# EasyEDA Pro project KeysDock.eprj, schematic keyboard

## Sheets
1 led: Board Name: keyboard; Create Date: 2025-10-22; Page Name: led; Project Name: KeysDock; Schematic Name: keyboard; Update Date: 2025-10-25; Company: keys.woooo.tech; Drawed: Reverier-Xu; Page Size: A4; Version: V1.0
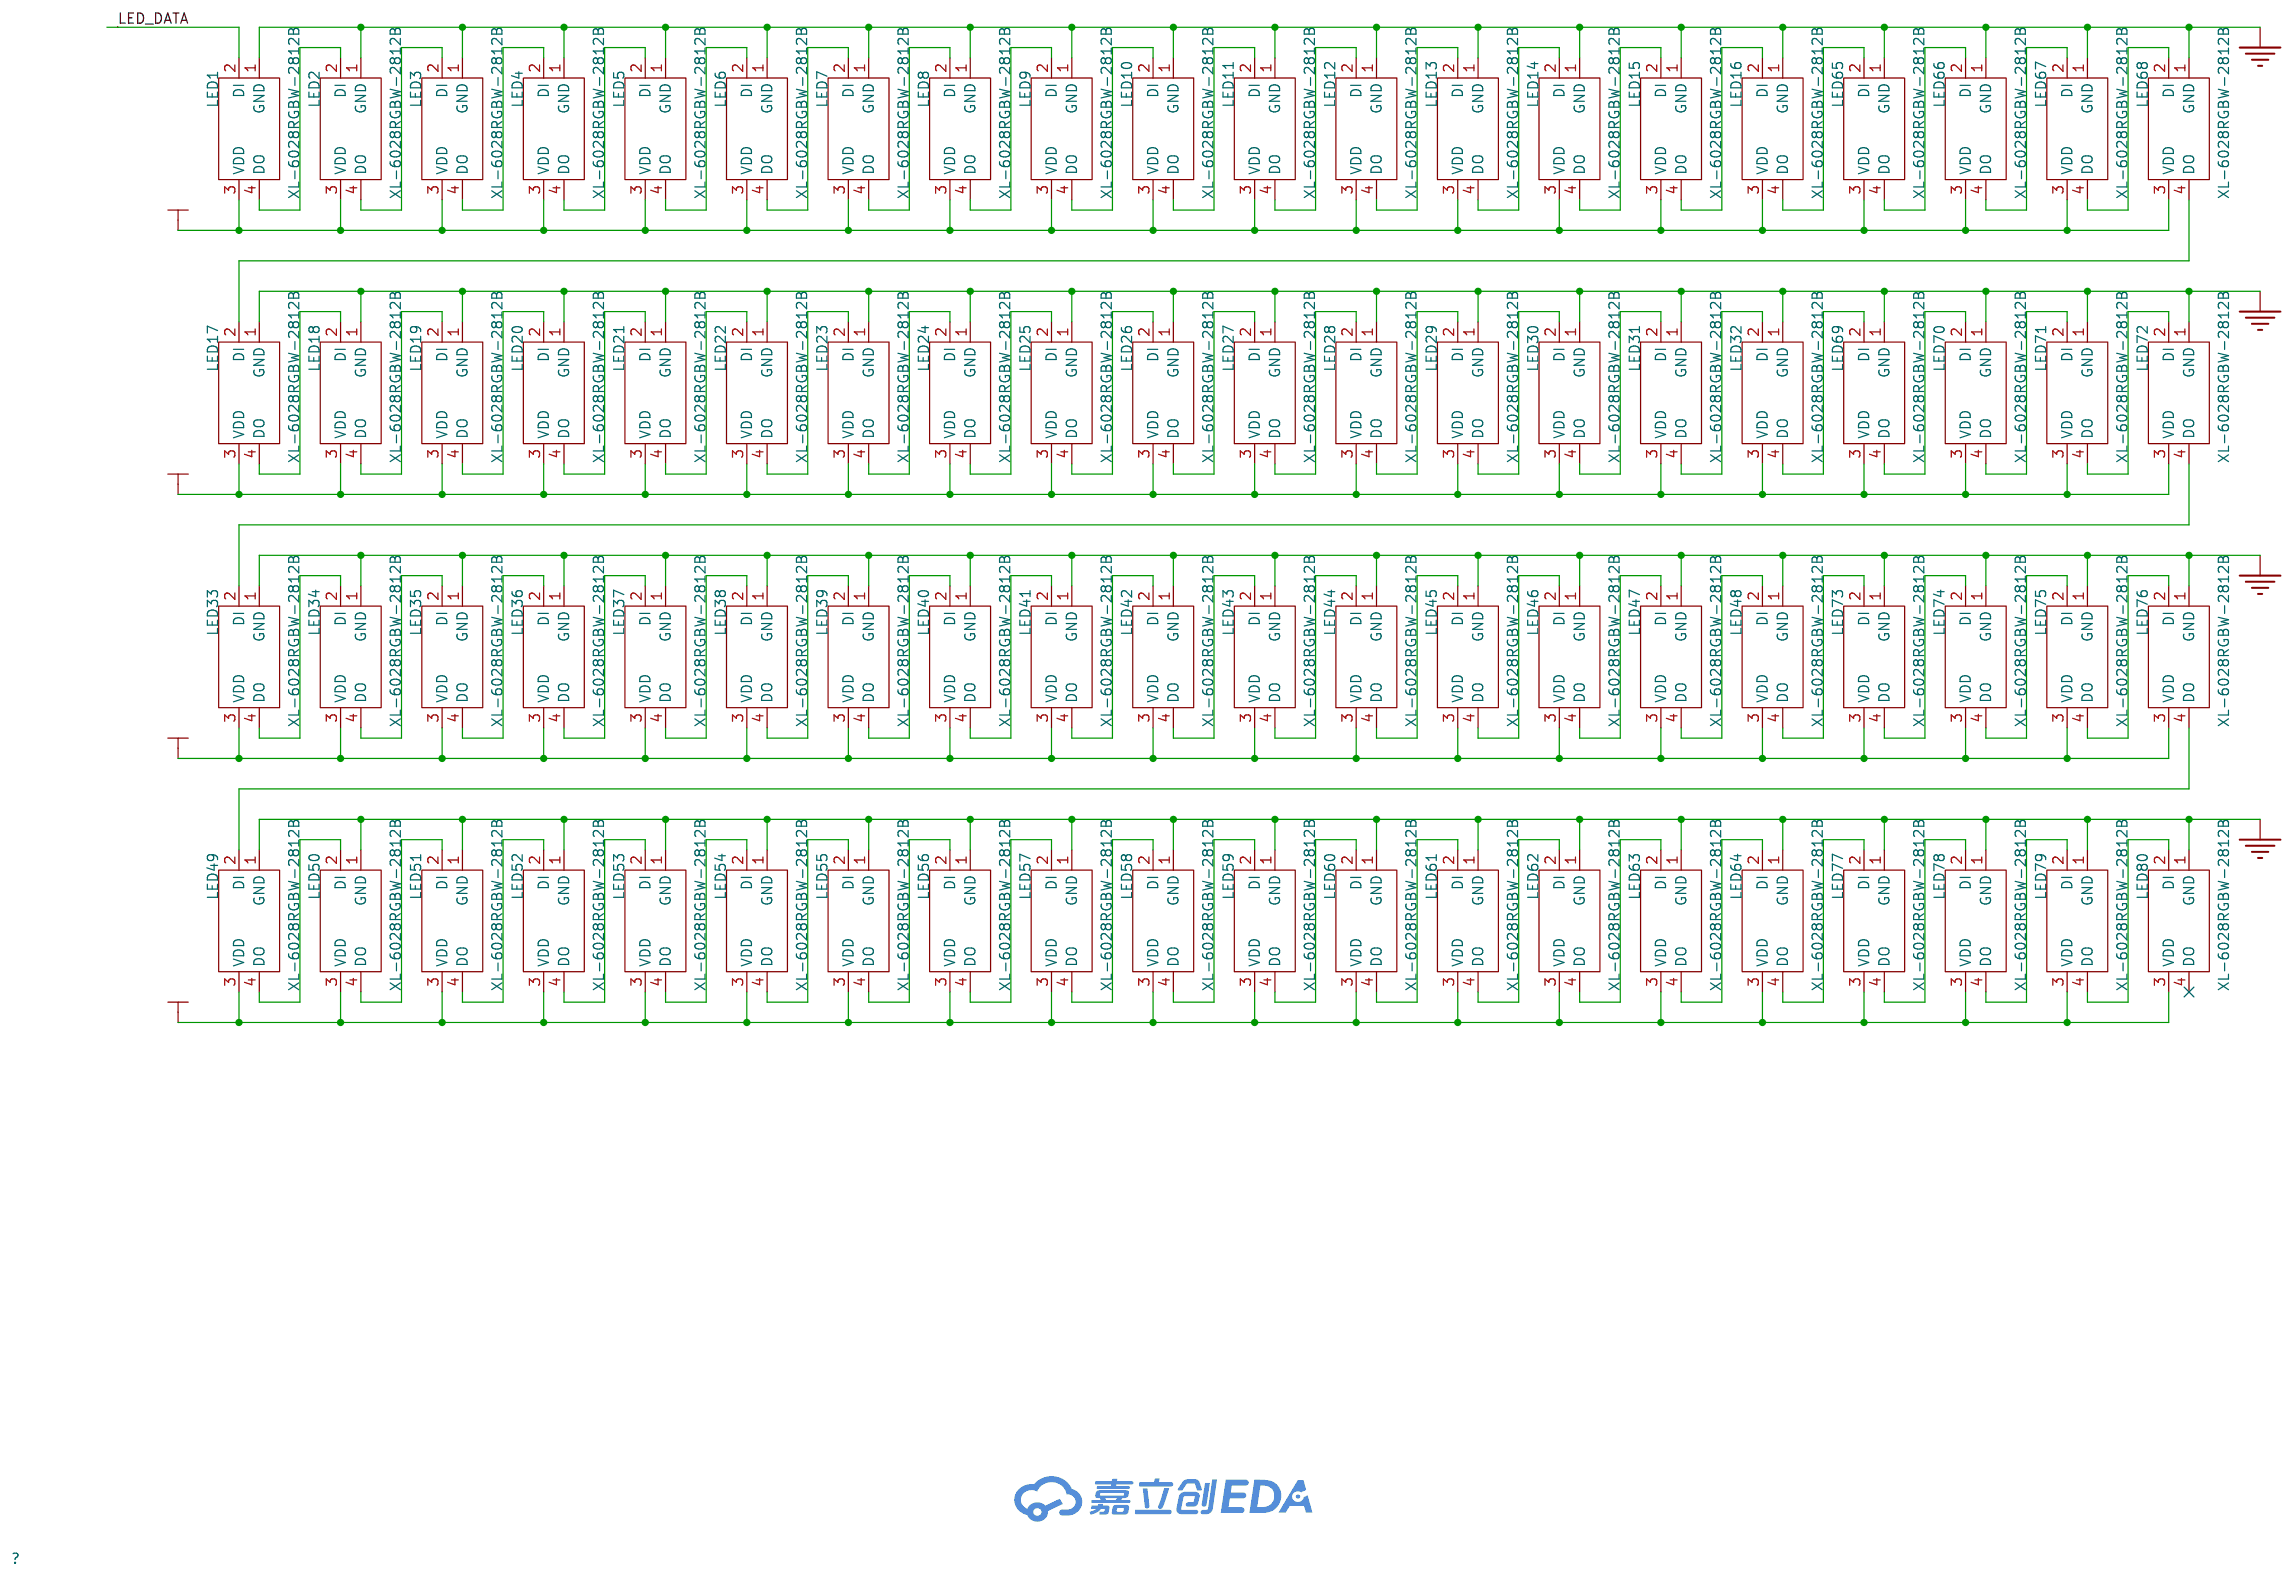
[diagram p4: led]
2 keys: Page Name: keys; Update Date: 2025-10-22
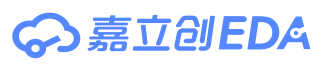
[diagram p5: keys]
3 connector: Create Date: 2025-10-25; Page Name: connector
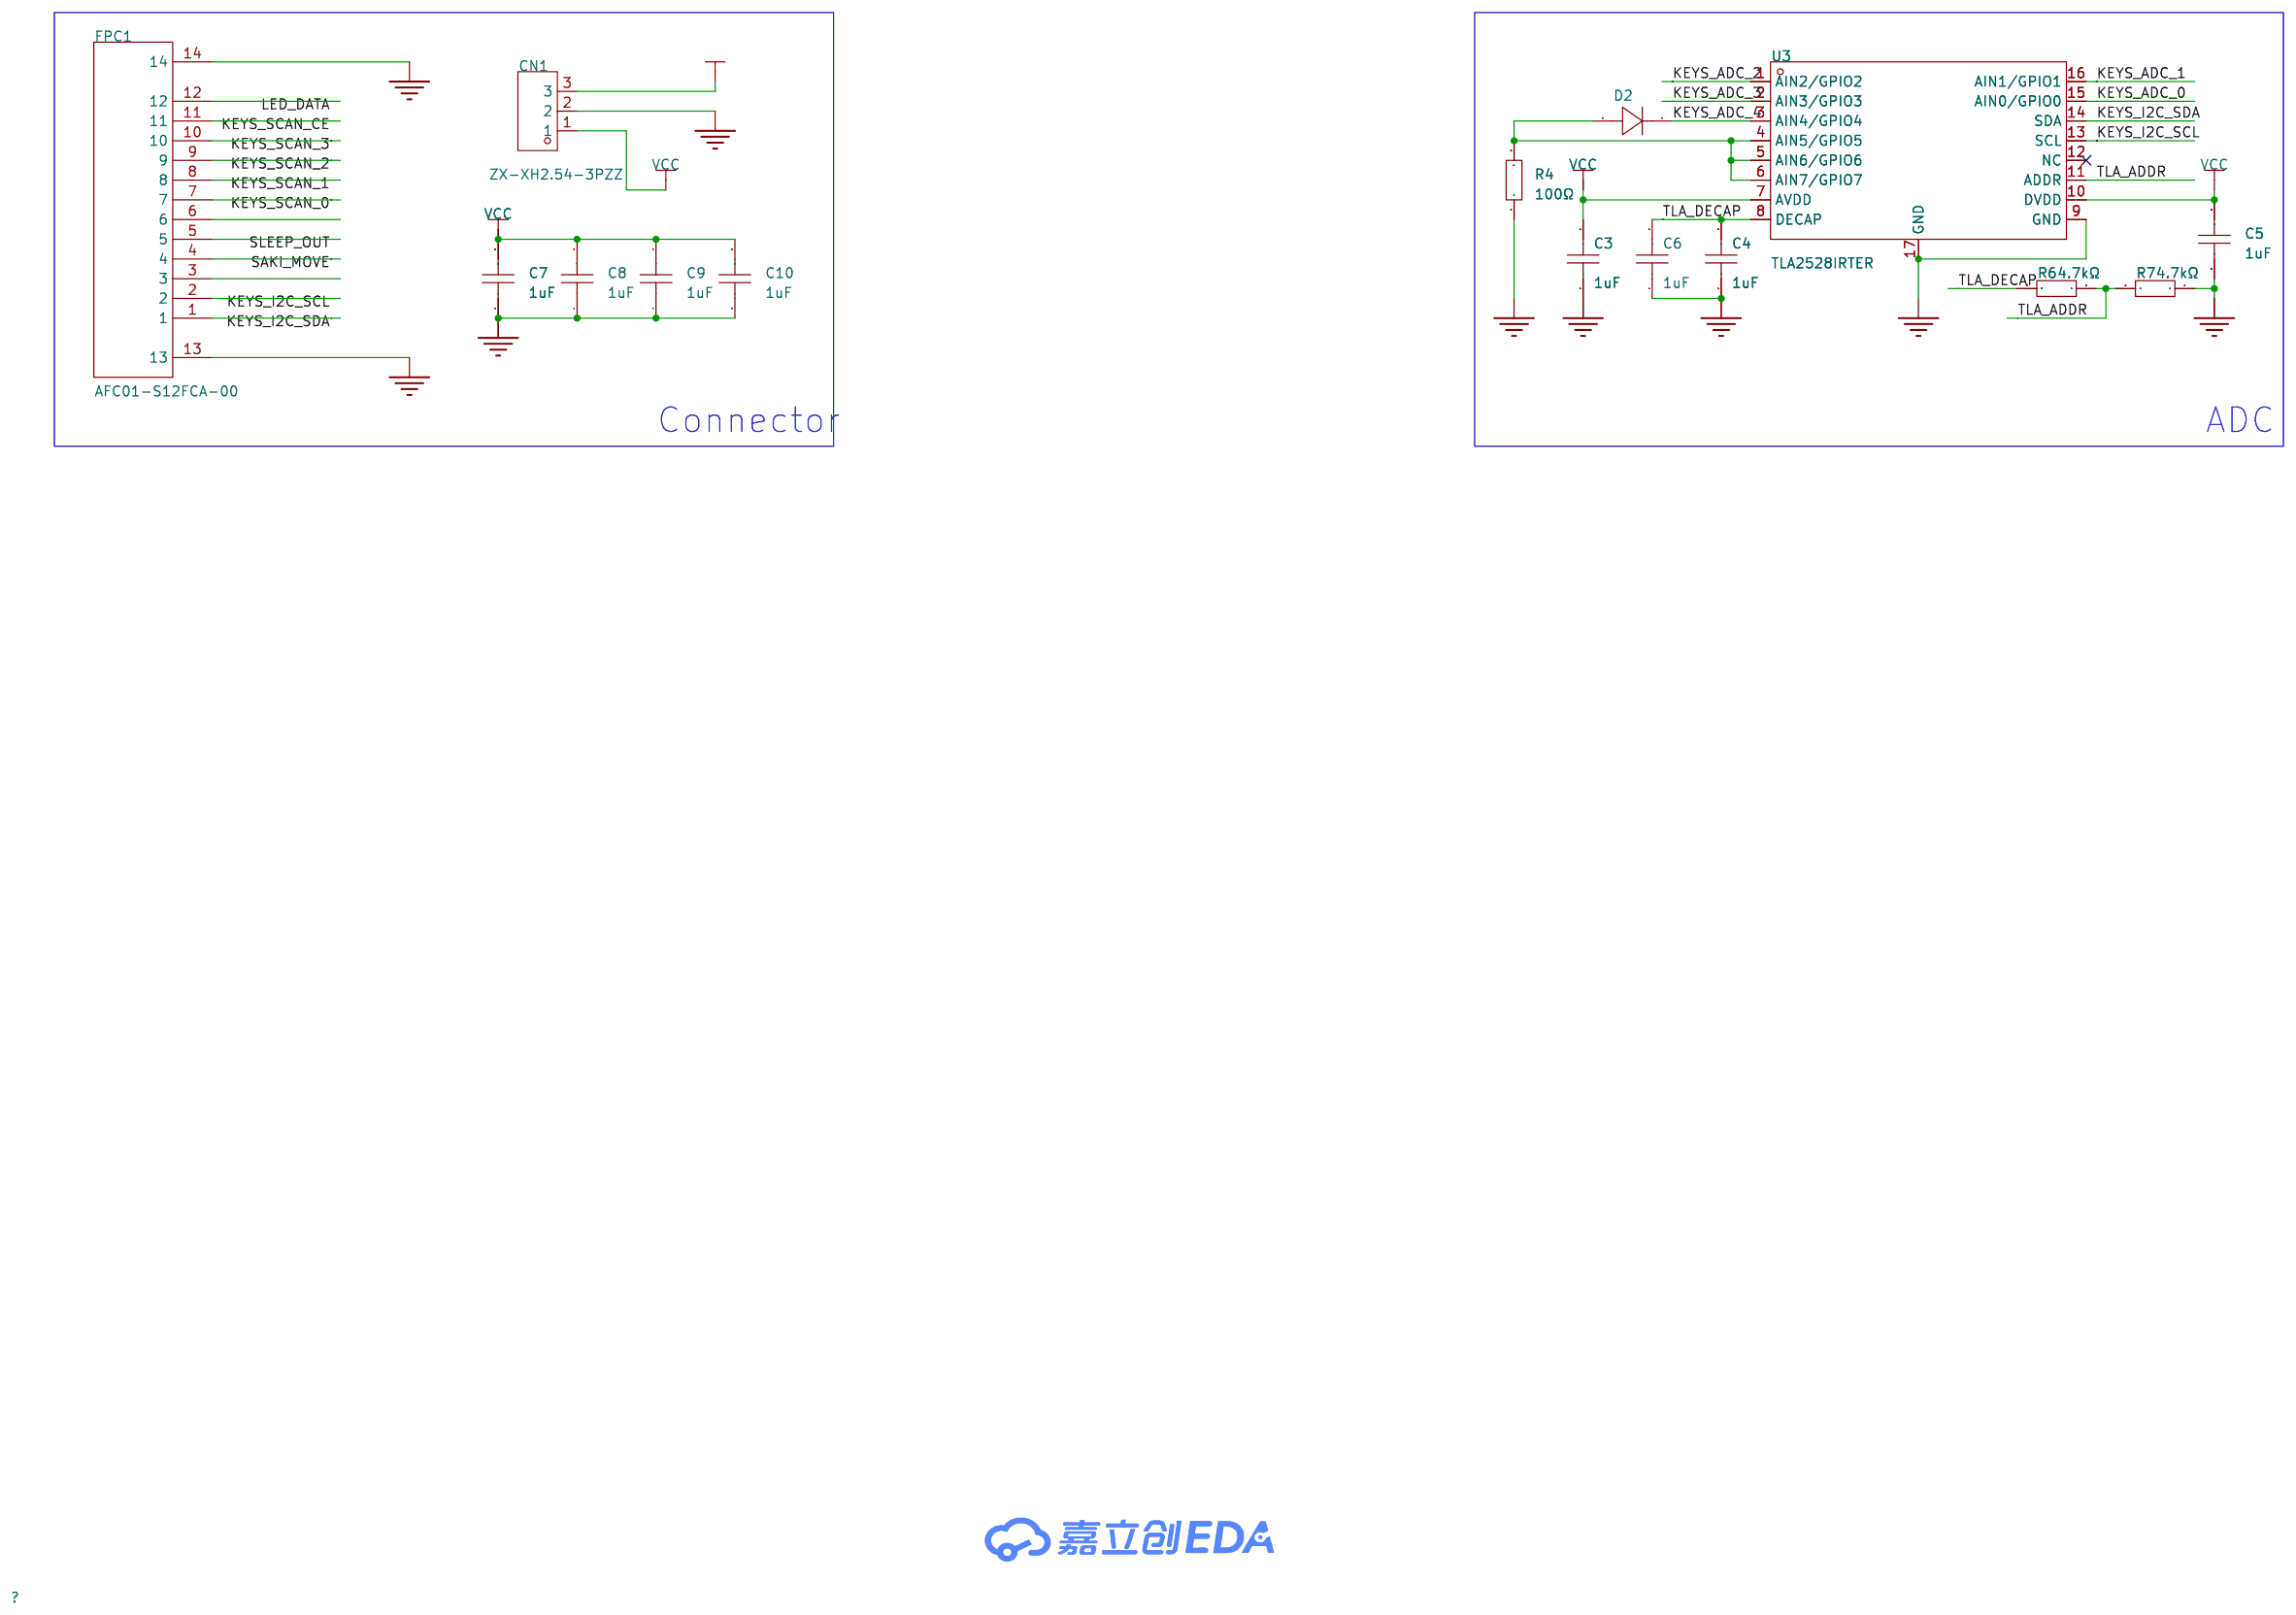
[diagram p6: connector]

## Parts
sheet connector
C3  1uF  [C0603]
C4  1uF  [C0603]
C5  1uF  [C0603]
C6  1uF  [C0603]
C7  1uF  [C0603]
C8  1uF  [C0603]
C9  1uF  [C0603]
C10  1uF  [C0603]
CN1  ZX-XH2.54-3PZZ  [CONN-TH_3P-P2.54_2501S-3P]
D2  -  [DO_1N4007]
FPC1  AFC01-S12FCA-00  [FPC-SMD_AFC01-S12FCA-00]
R4  100Ω  [R0402]
R6  4.7kΩ  [R0402]
R7  4.7kΩ  [R0402]
U3  TLA2528IRTER  [WQFN-16_L3.0-W3.0-P0.50-TL-EP1.7]
sheet led
LED1  XL-6028RGBW-2812B  [LED-SMD_4P_XL-6028RGBW-WS2812B]
LED2  XL-6028RGBW-2812B  [LED-SMD_4P_XL-6028RGBW-WS2812B]
LED3  XL-6028RGBW-2812B  [LED-SMD_4P_XL-6028RGBW-WS2812B]
LED4  XL-6028RGBW-2812B  [LED-SMD_4P_XL-6028RGBW-WS2812B]
LED5  XL-6028RGBW-2812B  [LED-SMD_4P_XL-6028RGBW-WS2812B]
LED6  XL-6028RGBW-2812B  [LED-SMD_4P_XL-6028RGBW-WS2812B]
LED7  XL-6028RGBW-2812B  [LED-SMD_4P_XL-6028RGBW-WS2812B]
LED8  XL-6028RGBW-2812B  [LED-SMD_4P_XL-6028RGBW-WS2812B]
LED9  XL-6028RGBW-2812B  [LED-SMD_4P_XL-6028RGBW-WS2812B]
LED10  XL-6028RGBW-2812B  [LED-SMD_4P_XL-6028RGBW-WS2812B]
LED11  XL-6028RGBW-2812B  [LED-SMD_4P_XL-6028RGBW-WS2812B]
LED12  XL-6028RGBW-2812B  [LED-SMD_4P_XL-6028RGBW-WS2812B]
LED13  XL-6028RGBW-2812B  [LED-SMD_4P_XL-6028RGBW-WS2812B]
LED14  XL-6028RGBW-2812B  [LED-SMD_4P_XL-6028RGBW-WS2812B]
LED15  XL-6028RGBW-2812B  [LED-SMD_4P_XL-6028RGBW-WS2812B]
LED16  XL-6028RGBW-2812B  [LED-SMD_4P_XL-6028RGBW-WS2812B]
LED17  XL-6028RGBW-2812B  [LED-SMD_4P_XL-6028RGBW-WS2812B]
LED18  XL-6028RGBW-2812B  [LED-SMD_4P_XL-6028RGBW-WS2812B]
LED19  XL-6028RGBW-2812B  [LED-SMD_4P_XL-6028RGBW-WS2812B]
LED20  XL-6028RGBW-2812B  [LED-SMD_4P_XL-6028RGBW-WS2812B]
LED21  XL-6028RGBW-2812B  [LED-SMD_4P_XL-6028RGBW-WS2812B]
LED22  XL-6028RGBW-2812B  [LED-SMD_4P_XL-6028RGBW-WS2812B]
LED23  XL-6028RGBW-2812B  [LED-SMD_4P_XL-6028RGBW-WS2812B]
LED24  XL-6028RGBW-2812B  [LED-SMD_4P_XL-6028RGBW-WS2812B]
LED25  XL-6028RGBW-2812B  [LED-SMD_4P_XL-6028RGBW-WS2812B]
LED26  XL-6028RGBW-2812B  [LED-SMD_4P_XL-6028RGBW-WS2812B]
LED27  XL-6028RGBW-2812B  [LED-SMD_4P_XL-6028RGBW-WS2812B]
LED28  XL-6028RGBW-2812B  [LED-SMD_4P_XL-6028RGBW-WS2812B]
LED29  XL-6028RGBW-2812B  [LED-SMD_4P_XL-6028RGBW-WS2812B]
LED30  XL-6028RGBW-2812B  [LED-SMD_4P_XL-6028RGBW-WS2812B]
LED31  XL-6028RGBW-2812B  [LED-SMD_4P_XL-6028RGBW-WS2812B]
LED32  XL-6028RGBW-2812B  [LED-SMD_4P_XL-6028RGBW-WS2812B]
LED33  XL-6028RGBW-2812B  [LED-SMD_4P_XL-6028RGBW-WS2812B]
LED34  XL-6028RGBW-2812B  [LED-SMD_4P_XL-6028RGBW-WS2812B]
LED35  XL-6028RGBW-2812B  [LED-SMD_4P_XL-6028RGBW-WS2812B]
LED36  XL-6028RGBW-2812B  [LED-SMD_4P_XL-6028RGBW-WS2812B]
LED37  XL-6028RGBW-2812B  [LED-SMD_4P_XL-6028RGBW-WS2812B]
LED38  XL-6028RGBW-2812B  [LED-SMD_4P_XL-6028RGBW-WS2812B]
LED39  XL-6028RGBW-2812B  [LED-SMD_4P_XL-6028RGBW-WS2812B]
LED40  XL-6028RGBW-2812B  [LED-SMD_4P_XL-6028RGBW-WS2812B]
LED41  XL-6028RGBW-2812B  [LED-SMD_4P_XL-6028RGBW-WS2812B]
LED42  XL-6028RGBW-2812B  [LED-SMD_4P_XL-6028RGBW-WS2812B]
LED43  XL-6028RGBW-2812B  [LED-SMD_4P_XL-6028RGBW-WS2812B]
LED44  XL-6028RGBW-2812B  [LED-SMD_4P_XL-6028RGBW-WS2812B]
LED45  XL-6028RGBW-2812B  [LED-SMD_4P_XL-6028RGBW-WS2812B]
LED46  XL-6028RGBW-2812B  [LED-SMD_4P_XL-6028RGBW-WS2812B]
LED47  XL-6028RGBW-2812B  [LED-SMD_4P_XL-6028RGBW-WS2812B]
LED48  XL-6028RGBW-2812B  [LED-SMD_4P_XL-6028RGBW-WS2812B]
LED49  XL-6028RGBW-2812B  [LED-SMD_4P_XL-6028RGBW-WS2812B]
LED50  XL-6028RGBW-2812B  [LED-SMD_4P_XL-6028RGBW-WS2812B]
LED51  XL-6028RGBW-2812B  [LED-SMD_4P_XL-6028RGBW-WS2812B]
LED52  XL-6028RGBW-2812B  [LED-SMD_4P_XL-6028RGBW-WS2812B]
LED53  XL-6028RGBW-2812B  [LED-SMD_4P_XL-6028RGBW-WS2812B]
LED54  XL-6028RGBW-2812B  [LED-SMD_4P_XL-6028RGBW-WS2812B]
LED55  XL-6028RGBW-2812B  [LED-SMD_4P_XL-6028RGBW-WS2812B]
LED56  XL-6028RGBW-2812B  [LED-SMD_4P_XL-6028RGBW-WS2812B]
LED57  XL-6028RGBW-2812B  [LED-SMD_4P_XL-6028RGBW-WS2812B]
LED58  XL-6028RGBW-2812B  [LED-SMD_4P_XL-6028RGBW-WS2812B]
LED59  XL-6028RGBW-2812B  [LED-SMD_4P_XL-6028RGBW-WS2812B]
LED60  XL-6028RGBW-2812B  [LED-SMD_4P_XL-6028RGBW-WS2812B]
LED61  XL-6028RGBW-2812B  [LED-SMD_4P_XL-6028RGBW-WS2812B]
LED62  XL-6028RGBW-2812B  [LED-SMD_4P_XL-6028RGBW-WS2812B]
LED63  XL-6028RGBW-2812B  [LED-SMD_4P_XL-6028RGBW-WS2812B]
LED64  XL-6028RGBW-2812B  [LED-SMD_4P_XL-6028RGBW-WS2812B]
LED65  XL-6028RGBW-2812B  [LED-SMD_4P_XL-6028RGBW-WS2812B]
LED66  XL-6028RGBW-2812B  [LED-SMD_4P_XL-6028RGBW-WS2812B]
LED67  XL-6028RGBW-2812B  [LED-SMD_4P_XL-6028RGBW-WS2812B]
LED68  XL-6028RGBW-2812B  [LED-SMD_4P_XL-6028RGBW-WS2812B]
LED69  XL-6028RGBW-2812B  [LED-SMD_4P_XL-6028RGBW-WS2812B]
LED70  XL-6028RGBW-2812B  [LED-SMD_4P_XL-6028RGBW-WS2812B]
LED71  XL-6028RGBW-2812B  [LED-SMD_4P_XL-6028RGBW-WS2812B]
LED72  XL-6028RGBW-2812B  [LED-SMD_4P_XL-6028RGBW-WS2812B]
LED73  XL-6028RGBW-2812B  [LED-SMD_4P_XL-6028RGBW-WS2812B]
LED74  XL-6028RGBW-2812B  [LED-SMD_4P_XL-6028RGBW-WS2812B]
LED75  XL-6028RGBW-2812B  [LED-SMD_4P_XL-6028RGBW-WS2812B]
LED76  XL-6028RGBW-2812B  [LED-SMD_4P_XL-6028RGBW-WS2812B]
LED77  XL-6028RGBW-2812B  [LED-SMD_4P_XL-6028RGBW-WS2812B]
LED78  XL-6028RGBW-2812B  [LED-SMD_4P_XL-6028RGBW-WS2812B]
LED79  XL-6028RGBW-2812B  [LED-SMD_4P_XL-6028RGBW-WS2812B]
LED80  XL-6028RGBW-2812B  [LED-SMD_4P_XL-6028RGBW-WS2812B]

## Library data of the parts
C3-C10 = CAP_0603: Supplier Footprint: 0603
CN1 = ZX-XH2.54-3PZZ: LCSC Part Name: 1x3P 间距:2.5mm 直插 系列:XH; Supplier Part: C7429633; Manufacturer: Megastar(兆星); Supplier Footprint: 插件,P=2.5mm; JLCPCB Part Class: 扩展库; Datasheet: https://item.szlcsc.com/datasheet/ZX-XH2.54-3PZZ/8427550.html; Supplier: LCSC; Pins Structure: 1x3P; Pitch: 2.5mm; Mounting Type: 直插; Reference Series: XH; Number of Pins: 3P; Number of Rows: 1; Number of PINs Per Row: 3; Current Rating: 3A; Contact Material: 黄铜; Contact Plating: 锡; Operating Temperature: -25℃~+85℃; Voltage Rating: 250V; Plastic Material: PA66; Flame Retardant Rating: UL94V-0; Color: 白色; Z-Height of the Board: 7mm; X-Length of Bottom Edge on Board (Spacing Line): 10mm; Y-Width of Bottom Edge on Board: 5.9mm
D2 = D_1N4007A: Supplier Footprint: DO-41
FPC1 = AFC01-S12FCA-00: LCSC Part Name: 间距:0.5mm P数:12P 翻盖式 下接; Supplier Part: C262661; Manufacturer: JS(钜硕电子); Supplier Footprint: SMD,P=0.5mm,卧贴; JLCPCB Part Class: 扩展库; Datasheet: https://item.szlcsc.com/datasheet/AFC01-S12FCA-00/253920.html; Supplier: LCSC; Locking Feature: 翻盖式; Contact Type: 下接; Number of Contacts: 12P; Pitch: 0.5mm; Mounting Type: 卧贴; FFC, FCB Thickness: 0.3mm; Height Above Board: 2mm
R4 = 0402WGF1000TCE: LCSC Part Name: 100Ω ±1% 62.5mW 厚膜电阻; Supplier Part: C25076; Manufacturer: UNI-ROYAL(厚声); Supplier Footprint: 0402; JLCPCB Part Class: Basic Part; Datasheet: https://atta.szlcsc.com/upload/public/pdf/source/20200306/C422600_1E6D84923E4A46A82E41ADD87F860B5C.pdf; Supplier: LCSC; Type: 厚膜电阻; Tolerance: ±1%; Power(Watts): 62.5mW; Overload Voltage (Max): 50V; Temperature Coefficient: ±200ppm/℃; Operating Temperature Range: -55℃~+155℃
R6 R7 = 0402WGF4701TCE: LCSC Part Name: 4.7kΩ ±1% 62.5mW 厚膜电阻; Supplier Part: C25900; Manufacturer: UNI-ROYAL(厚声); Supplier Footprint: 0402; JLCPCB Part Class: Basic Part; Datasheet: https://item.szlcsc.com/datasheet/0402WGF4701TCE/26643.html; Supplier: LCSC; Type: 厚膜电阻; Tolerance: ±1%; Power(Watts): 62.5mW; Voltage-Supply(Max): 50V; Temperature Coefficient: ±100ppm/℃; Operating Temperature: -55℃~+155℃
U3 = TLA2528IRTER: LCSC Part Name: 小型8通道12位ADC，具有I²C接口及GPIO; Supplier Part: C2866175; Manufacturer: TI(德州仪器); Supplier Footprint: WQFN-16-EP(3x3); JLCPCB Part Class: 扩展库; Datasheet: https://www.ti.com/cn/lit/gpn/tla2528; Supplier: LCSC; Resolution(Bits): 12位; number of channels: 8; Voltage - Supply: 2.35V~5.5V；1.65V~5.5V; Interface: I2C; differential input: 否; Integral non - linearity: 0.5LSB; Operating Temperature: -40℃~+85℃; Signal-to-Noise Ratio: 71.5dB; Clock/Oscillator: 内置; Voltage Reference: 外置; ADC architecture: SAR; Supply Current (Iq): 5uA
LED1-LED80 = XL-6028RGBW-2812B: LCSC Part Name: XL-6028RGBW-WS2812B; Supplier Part: C42163197; Manufacturer: XINGLIGHT(成兴光); Supplier Footprint: SMD-4P,3.2x2.8mm; JLCPCB Part Class: 扩展库; Datasheet: https://item.szlcsc.com/datasheet/XL-6028RGBW-2812B/44033758.html; Supplier: LCSC; Wavelength: 515nm；620nm~630nm；525nm; Luminous Intensity: 800mcd；150mcd；180mcd; Fixed-Frequency Pwm Mode: 1.5kHz; Data Transmission Rate: 800Kbit/s; Voltage - Supply: 4.5V~5.5V; ESD Withstand Voltage: 3000V; Operating Temperature: -40℃~+85℃; Peak Wavelength: R:625nm；B:470nm；G:525nm; Viewing Angle: 120°; Length: 5.9mm; Width: 1.8mm; Height: 2.8mm

## Nets
GND: C3.1 C4.1 C5.1 C6.1 C7.1 C8.1 C9.1 C10.1 CN1.2 FPC1.13 FPC1.14 LED1.1(GND) LED2.1(GND) LED3.1(GND) LED4.1(GND) LED5.1(GND) LED6.1(GND) LED7.1(GND) LED8.1(GND) LED9.1(GND) LED10.1(GND) LED11.1(GND) LED12.1(GND) LED13.1(GND) LED14.1(GND) LED15.1(GND) LED16.1(GND) LED17.1(GND) LED18.1(GND) LED19.1(GND) LED20.1(GND) LED21.1(GND) LED22.1(GND) LED23.1(GND) LED24.1(GND) LED25.1(GND) LED26.1(GND) LED27.1(GND) LED28.1(GND) LED29.1(GND) LED30.1(GND) LED31.1(GND) LED32.1(GND) LED33.1(GND) LED34.1(GND) LED35.1(GND) LED36.1(GND) LED37.1(GND) LED38.1(GND) LED39.1(GND) LED40.1(GND) LED41.1(GND) LED42.1(GND) LED43.1(GND) LED44.1(GND) LED45.1(GND) LED46.1(GND) LED47.1(GND) LED48.1(GND) LED49.1(GND) LED50.1(GND) LED51.1(GND) LED52.1(GND) LED53.1(GND) LED54.1(GND) LED55.1(GND) LED56.1(GND) LED57.1(GND) LED58.1(GND) LED59.1(GND) LED60.1(GND) LED61.1(GND) LED62.1(GND) LED63.1(GND) LED64.1(GND) LED65.1(GND) LED66.1(GND) LED67.1(GND) LED68.1(GND) LED69.1(GND) LED70.1(GND) LED71.1(GND) LED72.1(GND) LED73.1(GND) LED74.1(GND) LED75.1(GND) LED76.1(GND) LED77.1(GND) LED78.1(GND) LED79.1(GND) LED80.1(GND) R4.1 R7.1 U3.9(GND) U3.17(GND)
VCC: C3.2 C5.2 C7.2 C8.2 C9.2 C10.2 CN1.1 U3.7(AVDD) U3.10(DVDD)
VCC_BAT: CN1.3 LED1.3(VDD) LED2.3(VDD) LED3.3(VDD) LED4.3(VDD) LED5.3(VDD) LED6.3(VDD) LED7.3(VDD) LED8.3(VDD) LED9.3(VDD) LED10.3(VDD) LED11.3(VDD) LED12.3(VDD) LED13.3(VDD) LED14.3(VDD) LED15.3(VDD) LED16.3(VDD) LED17.3(VDD) LED18.3(VDD) LED19.3(VDD) LED20.3(VDD) LED21.3(VDD) LED22.3(VDD) LED23.3(VDD) LED24.3(VDD) LED25.3(VDD) LED26.3(VDD) LED27.3(VDD) LED28.3(VDD) LED29.3(VDD) LED30.3(VDD) LED31.3(VDD) LED32.3(VDD) LED33.3(VDD) LED34.3(VDD) LED35.3(VDD) LED36.3(VDD) LED37.3(VDD) LED38.3(VDD) LED39.3(VDD) LED40.3(VDD) LED41.3(VDD) LED42.3(VDD) LED43.3(VDD) LED44.3(VDD) LED45.3(VDD) LED46.3(VDD) LED47.3(VDD) LED48.3(VDD) LED49.3(VDD) LED50.3(VDD) LED51.3(VDD) LED52.3(VDD) LED53.3(VDD) LED54.3(VDD) LED55.3(VDD) LED56.3(VDD) LED57.3(VDD) LED58.3(VDD) LED59.3(VDD) LED60.3(VDD) LED61.3(VDD) LED62.3(VDD) LED63.3(VDD) LED64.3(VDD) LED65.3(VDD) LED66.3(VDD) LED67.3(VDD) LED68.3(VDD) LED69.3(VDD) LED70.3(VDD) LED71.3(VDD) LED72.3(VDD) LED73.3(VDD) LED74.3(VDD) LED75.3(VDD) LED76.3(VDD) LED77.3(VDD) LED78.3(VDD) LED79.3(VDD) LED80.3(VDD)
KEYS_ADC_0: U3.15(AIN0/GPIO0)
KEYS_ADC_1: U3.16(AIN1/GPIO1)
KEYS_ADC_2: U3.1(AIN2/GPIO2)
KEYS_ADC_3: U3.2(AIN3/GPIO3)
KEYS_ADC_4: D2.1(K) U3.3(AIN4/GPIO4)
KEYS_I2C_SCL: FPC1.2 U3.13(SCL)
KEYS_I2C_SDA: FPC1.1 U3.14(SDA)
KEYS_SCAN_0: FPC1.7
KEYS_SCAN_1: FPC1.8
KEYS_SCAN_2: FPC1.9
KEYS_SCAN_3: FPC1.10
KEYS_SCAN_CE: FPC1.11
LED_DATA: FPC1.12 LED1.2(DI)
SAKI_MOVE: FPC1.4
SLEEP_OUT: FPC1.5
TLA_ADDR: R6.1 R7.2 U3.11(ADDR)
TLA_DECAP: C4.2 C6.2 R6.2 U3.8(DECAP)
Net-(D2-2): D2.2(A) R4.2 U3.4(AIN5/GPIO5) U3.5(AIN6/GPIO6) U3.6(AIN7/GPIO7)
Net-(LED1-4): LED1.4(DO) LED2.2(DI)
Net-(LED2-4): LED2.4(DO) LED3.2(DI)
Net-(LED3-4): LED3.4(DO) LED4.2(DI)
Net-(LED4-4): LED4.4(DO) LED5.2(DI)
Net-(LED5-4): LED5.4(DO) LED6.2(DI)
Net-(LED6-4): LED6.4(DO) LED7.2(DI)
Net-(LED7-4): LED7.4(DO) LED8.2(DI)
Net-(LED8-4): LED8.4(DO) LED9.2(DI)
Net-(LED9-4): LED9.4(DO) LED10.2(DI)
Net-(LED10-4): LED10.4(DO) LED11.2(DI)
Net-(LED11-4): LED11.4(DO) LED12.2(DI)
Net-(LED12-4): LED12.4(DO) LED13.2(DI)
Net-(LED13-4): LED13.4(DO) LED14.2(DI)
Net-(LED14-4): LED14.4(DO) LED15.2(DI)
Net-(LED15-4): LED15.4(DO) LED16.2(DI)
Net-(LED16-4): LED16.4(DO) LED65.2(DI)
Net-(LED17-2): LED17.2(DI) LED68.4(DO)
Net-(LED17-4): LED17.4(DO) LED18.2(DI)
Net-(LED18-4): LED18.4(DO) LED19.2(DI)
Net-(LED19-4): LED19.4(DO) LED20.2(DI)
Net-(LED20-4): LED20.4(DO) LED21.2(DI)
Net-(LED21-4): LED21.4(DO) LED22.2(DI)
Net-(LED22-4): LED22.4(DO) LED23.2(DI)
Net-(LED23-4): LED23.4(DO) LED24.2(DI)
Net-(LED24-4): LED24.4(DO) LED25.2(DI)
Net-(LED25-4): LED25.4(DO) LED26.2(DI)
Net-(LED26-4): LED26.4(DO) LED27.2(DI)
Net-(LED27-4): LED27.4(DO) LED28.2(DI)
Net-(LED28-4): LED28.4(DO) LED29.2(DI)
Net-(LED29-4): LED29.4(DO) LED30.2(DI)
Net-(LED30-4): LED30.4(DO) LED31.2(DI)
Net-(LED31-4): LED31.4(DO) LED32.2(DI)
Net-(LED32-4): LED32.4(DO) LED69.2(DI)
Net-(LED33-2): LED33.2(DI) LED72.4(DO)
Net-(LED33-4): LED33.4(DO) LED34.2(DI)
Net-(LED34-4): LED34.4(DO) LED35.2(DI)
Net-(LED35-4): LED35.4(DO) LED36.2(DI)
Net-(LED36-4): LED36.4(DO) LED37.2(DI)
Net-(LED37-4): LED37.4(DO) LED38.2(DI)
Net-(LED38-4): LED38.4(DO) LED39.2(DI)
Net-(LED39-4): LED39.4(DO) LED40.2(DI)
Net-(LED40-4): LED40.4(DO) LED41.2(DI)
Net-(LED41-4): LED41.4(DO) LED42.2(DI)
Net-(LED42-4): LED42.4(DO) LED43.2(DI)
Net-(LED43-4): LED43.4(DO) LED44.2(DI)
Net-(LED44-4): LED44.4(DO) LED45.2(DI)
Net-(LED45-4): LED45.4(DO) LED46.2(DI)
Net-(LED46-4): LED46.4(DO) LED47.2(DI)
Net-(LED47-4): LED47.4(DO) LED48.2(DI)
Net-(LED48-4): LED48.4(DO) LED73.2(DI)
Net-(LED49-2): LED49.2(DI) LED76.4(DO)
Net-(LED49-4): LED49.4(DO) LED50.2(DI)
Net-(LED50-4): LED50.4(DO) LED51.2(DI)
Net-(LED51-4): LED51.4(DO) LED52.2(DI)
Net-(LED52-4): LED52.4(DO) LED53.2(DI)
Net-(LED53-4): LED53.4(DO) LED54.2(DI)
Net-(LED54-4): LED54.4(DO) LED55.2(DI)
Net-(LED55-4): LED55.4(DO) LED56.2(DI)
Net-(LED56-4): LED56.4(DO) LED57.2(DI)
Net-(LED57-4): LED57.4(DO) LED58.2(DI)
Net-(LED58-4): LED58.4(DO) LED59.2(DI)
Net-(LED59-4): LED59.4(DO) LED60.2(DI)
Net-(LED60-4): LED60.4(DO) LED61.2(DI)
Net-(LED61-4): LED61.4(DO) LED62.2(DI)
Net-(LED62-4): LED62.4(DO) LED63.2(DI)
Net-(LED63-4): LED63.4(DO) LED64.2(DI)
Net-(LED64-4): LED64.4(DO) LED77.2(DI)
Net-(LED65-4): LED65.4(DO) LED66.2(DI)
Net-(LED66-4): LED66.4(DO) LED67.2(DI)
Net-(LED67-4): LED67.4(DO) LED68.2(DI)
Net-(LED69-4): LED69.4(DO) LED70.2(DI)
Net-(LED70-4): LED70.4(DO) LED71.2(DI)
Net-(LED71-4): LED71.4(DO) LED72.2(DI)
Net-(LED73-4): LED73.4(DO) LED74.2(DI)
Net-(LED74-4): LED74.4(DO) LED75.2(DI)
Net-(LED75-4): LED75.4(DO) LED76.2(DI)
Net-(LED77-4): LED77.4(DO) LED78.2(DI)
Net-(LED78-4): LED78.4(DO) LED79.2(DI)
Net-(LED79-4): LED79.4(DO) LED80.2(DI)

Not connected (* = marked no-connect by the designer): FPC1 3 6; LED80 4(DO)*; U3 12(NC)*

## Notes on the sheets
sheet 3
- Connector
- ADC
